# EAGLE design vezerlo_V2 (EAGLE 8.1.1)
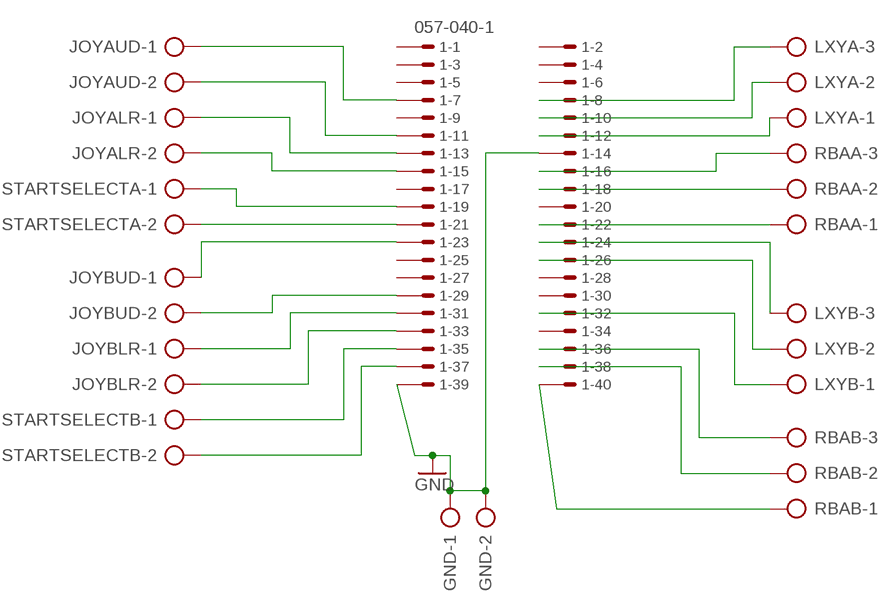
[diagram p0: schematic, sheet 1]

## Parts
1  057-040-1  [057-040-1]
GND  AK500/2-H  [AK500/2-H]
JOYALR  AK500/2-H  [AK500/2-H]
JOYAUD  AK500/2-H  [AK500/2-H]
JOYBLR  AK500/2-H  [AK500/2-H]
JOYBUD  AK500/2-H  [AK500/2-H]
LXYA  AK500/3-H  [AK500/3-H]
LXYB  AK500/3-H  [AK500/3-H]
RBAA  AK500/3-H  [AK500/3-H]
RBAB  AK500/3-H  [AK500/3-H]
STARTSELECTA  AK500/2-H  [AK500/2-H]
STARTSELECTB  AK500/2-H  [AK500/2-H]

## Nets
GND: 1.14 1.39 GND.1 GND.2
N$1: 1.7 JOYAUD.1
N$2: 1.11 JOYAUD.2
N$3: 1.13 JOYALR.1
N$4: 1.15 JOYALR.2
N$5: 1.19 STARTSELECTA.1
N$6: 1.21 STARTSELECTA.2
N$7: 1.23 JOYBUD.1
N$8: 1.29 JOYBUD.2
N$9: 1.31 JOYBLR.1
N$10: 1.33 JOYBLR.2
N$11: 1.35 STARTSELECTB.1
N$12: 1.37 STARTSELECTB.2
N$14: 1.8 LXYA.3
N$15: 1.10 LXYA.2
N$16: 1.12 LXYA.1
N$17: 1.16 RBAA.3
N$18: 1.18 RBAA.2
N$19: 1.22 RBAA.1
N$20: 1.24 LXYB.3
N$21: 1.26 LXYB.2
N$22: 1.32 LXYB.1
N$23: 1.36 RBAB.3
N$24: 1.38 RBAB.2
N$25: 1.40 RBAB.1
Unconnected: 1.1 1.2 1.3 1.4 1.5 1.6 1.9 1.17 1.20 1.25 1.27 1.28 1.30 1.34

## Library data of the parts
1 = con-panduit:057-040-: CONNECTOR 40-pin series 057 contact pc board low profile headers; OC_FARNELL: unknown; OC_NEWARK: unknown
GND JOYALR JOYAUD JOYBLR JOYBUD STARTSELECTA STARTSELECTB = con-ptr500:AK500/2-H: CONNECTOR Aug. 2004 / PTR Meßtechnik: Die Bezeichnung der Serie AK505 wurde geändert. Es handelt sich hierbei um AK500 in horizontaler Ausführung.; OC_FARNELL: unknown; OC_NEWARK: unknown
LXYA LXYB RBAA RBAB = con-ptr500:AK500/3-H: CONNECTOR Aug. 2004 / PTR Meßtechnik: Die Bezeichnung der Serie AK505 wurde geändert. Es handelt sich hierbei um AK500 in horizontaler Ausführung.; OC_FARNELL: unknown; OC_NEWARK: unknown

## Board
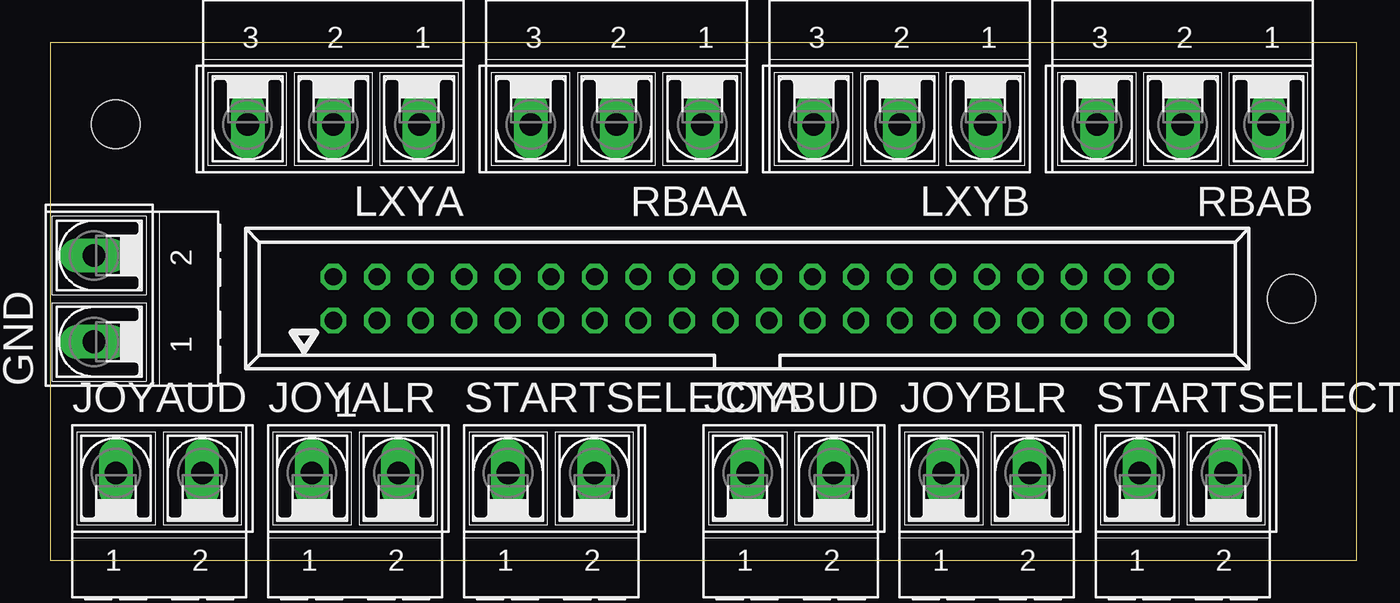
[diagram p1: board, top side]
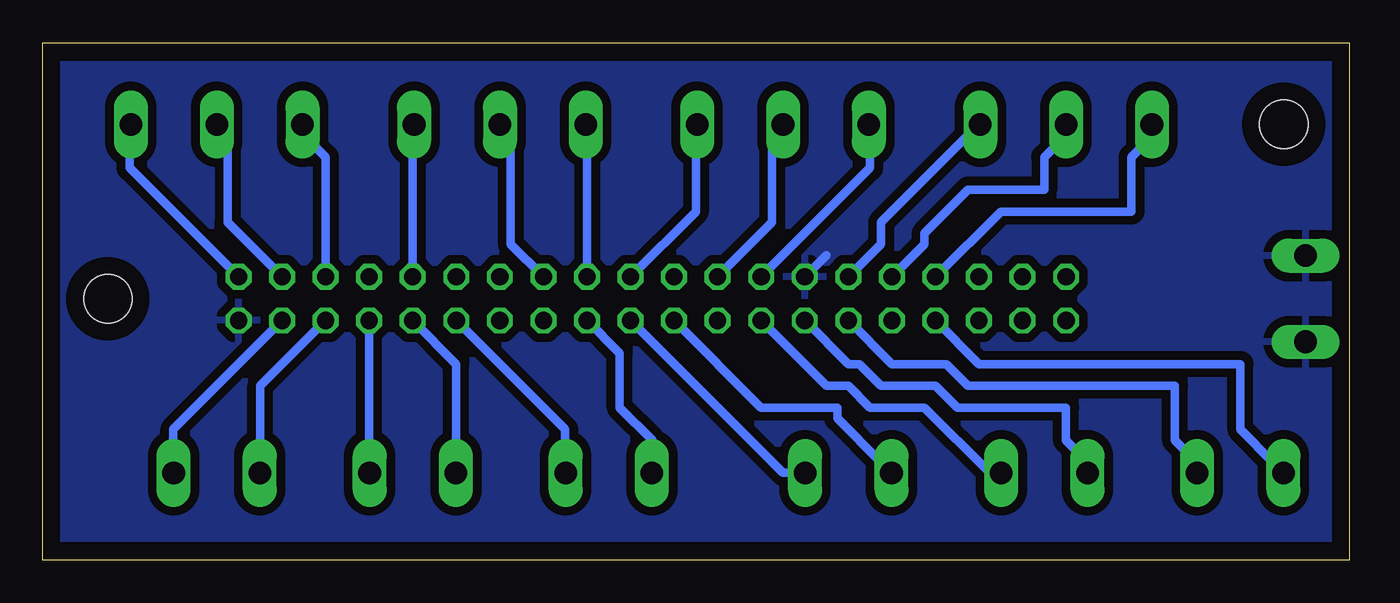
[diagram p2: board, bottom side, seen from below]

Size 76.18 x 30.15 mm. Coordinates in mm from the lower left corner, seen from the top.
Outline: 0,0 76.18,0 76.18,30.15 0,30.15 0,0
Copper layers (1*16): Top 0.035mm / dielectric 1.5mm / Bottom 0.035mm
Design rules "default *": minimum track width 20mil, minimum drill 24mil, track to track 20mil, track to pad 20mil, pad to pad 20mil, via to via 20mil, smd to smd 8mil, copper to edge 40mil, drill to drill 20mil, minimum pad ring 10mil, minimum via ring 8mil, stop-mask expansion 4mil, vias tented up to drill 0mil, thermal gap 20mil
Holes 2.8 mm at 3.81,25.4 72.39,15.24

### Footprints (pad centres in the part's own frame; a part is rotated, then mirrored left to right if it is on the bottom)
057-040-1 = drill 1 octagon: 1 -24.13,-1.27; 2 -24.13,1.27; 3 -21.59,-1.27; 4 -21.59,1.27; 5 -19.05,-1.27; 6 -19.05,1.27; 7 -16.51,-1.27; 8 -16.51,1.27; 9 -13.97,-1.27; 10 -13.97,1.27; 11 -11.43,-1.27; 12 -11.43,1.27; 13 -8.89,-1.27; 14 -8.89,1.27; 15 -6.35,-1.27; 16 -6.35,1.27; 17 -3.81,-1.27; 18 -3.81,1.27; 19 -1.27,-1.27; 20 -1.27,1.27; 21 1.27,-1.27; 22 1.27,1.27; 23 3.81,-1.27; 24 3.81,1.27; 25 6.35,-1.27; 26 6.35,1.27; 27 8.89,-1.27; 28 8.89,1.27; 29 11.43,-1.27; 30 11.43,1.27; 31 13.97,-1.27; 32 13.97,1.27; 33 16.51,-1.27; 34 16.51,1.27; 35 19.05,-1.27; 36 19.05,1.27; 37 21.59,-1.27; 38 21.59,1.27; 39 24.13,-1.27; 40 24.13,1.27
AK500/2-H = drill 1.321 long: 1 -2.515,0; 2 2.515,0
AK500/3-H = drill 1.321 long: 1 -5.004,0; 2 0,0; 3 5.004,0

### Placement (x,y rotation side)
1  40.64,15.24 0 top
GND  2.54,15.24 90 top
JOYALR  17.78,5.08 0 top
JOYAUD  6.35,5.08 0 top
JOYBLR  54.61,5.08 0 top
JOYBUD  43.18,5.08 0 top
LXYA  16.51,25.4 180 top
LXYB  49.53,25.4 180 top
RBAA  33.02,25.4 180 top
RBAB  66.04,25.4 180 top
STARTSELECTA  29.21,5.08 0 top
STARTSELECTB  66.04,5.08 0 top

### Tracks (layer width: path | path; a pad name or v marks a point on that pad's centre or on a via)
GND
  Bottom 0.508: 30.48,17.78 1.14
  pour Bottom: 0,1.27 0,29.21 76.2,29.21 76.2,1.27
N$1
  Bottom 0.508: 1.7 21.59,11.43 6.35,11.43 6.35,7.62 4.45,5.71 4.45,5.08 JOYAUD.1
N$2
  Bottom 0.508: 1.11 26.67,11.43 23.5,11.43 22.23,10.16 10.16,10.16 10.16,6.99 8.89,5.71 8.89,5.08 JOYAUD.2
N$3
  Bottom 0.508: 1.13 29.21,11.43 28.57,11.43 27.3,10.16 24.13,10.16 22.86,8.89 16.51,8.89 16.51,6.99 15.88,6.35 15.88,5.08 JOYALR.1
N$4
  Bottom 0.508: 1.15 30.48,10.16 29.21,10.16 27.94,8.89 24.77,8.89 20.96,5.08 JOYALR.2
N$5
  Bottom 0.508: 1.19 34.29,8.89 29.84,8.89 29.84,8.26 27.3,5.71 27.3,5.08 STARTSELECTA.1
N$6
  Bottom 0.508: 1.21 33.02,5.08 STARTSELECTA.2
N$7
  Bottom 0.508: 1.23 42.54,12.07 42.54,8.89 40.64,6.99 40.64,5.08 JOYBUD.1
N$8
  Bottom 0.508: 1.29 45.72,7.62 45.72,5.08 JOYBUD.2
N$9
  Bottom 0.508: 1.31 52.07,11.43 52.07,5.08 JOYBLR.1
N$10
  Bottom 0.508: 1.33 57.15,5.08 JOYBLR.2
N$11
  Bottom 0.508: 1.35 63.5,10.16 63.5,5.08 STARTSELECTB.1
N$12
  Bottom 0.508: 1.37 68.58,7.62 68.58,5.08 STARTSELECTB.2
N$14
  Bottom 0.508: 1.8 20.32,20.32 12.7,20.32 12.7,23.5 12.07,24.13 12.07,25.4 LXYA.3
N$15
  Bottom 0.508: 1.10 24.77,18.41 24.77,19.05 22.23,21.59 17.78,21.59 17.78,23.5 16.51,24.77 LXYA.2
N$16
  Bottom 0.508: 1.12 27.3,18.41 27.3,19.68 21.59,25.4 LXYA.1
N$17
  Bottom 0.508: 1.16 27.94,22.86 27.94,25.4 RBAA.3
N$18
  Bottom 0.508: 1.18 33.65,19.68 33.65,24.77 RBAA.2
N$19
  Bottom 0.508: 1.22 38.1,20.32 38.1,25.4 RBAA.1
N$20
  Bottom 0.508: 1.24 44.45,25.4 LXYB.3
N$21
  Bottom 0.508: 1.26 48.89,18.41 48.89,24.77 LXYB.2
N$22
  Bottom 0.508: 1.32 54.61,25.4 LXYB.1
N$23
  Bottom 0.508: 1.36 59.69,23.5 60.96,24.77 60.96,25.4 RBAB.3
N$24
  Bottom 0.508: 1.38 65.41,19.68 65.41,24.77 RBAB.2
N$25
  Bottom 0.508: 1.40 71.12,22.86 71.12,25.4 RBAB.1